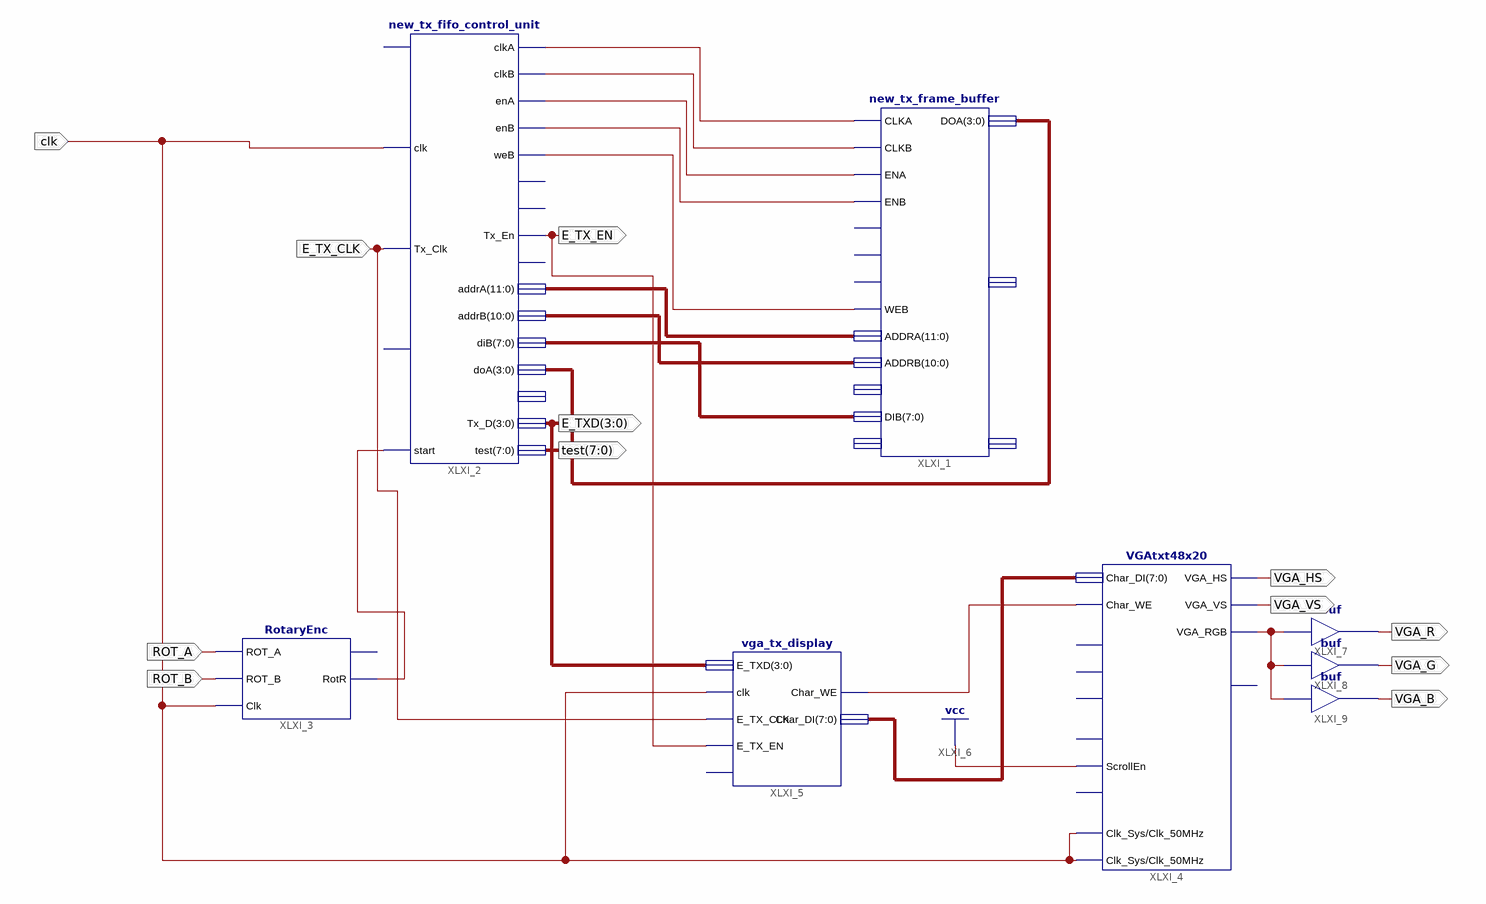
[diagram p0: schematic sheet 1]
// Xilinx ISE schematic tx_schem.sch (spartan3e) as structural Verilog: 8 symbols, 12 ports
module tx_schem (
  input  clk,
  input  E_TX_CLK,
  input  ROT_A,
  input  ROT_B,
  output VGA_HS,
  output VGA_VS,
  output VGA_B,
  output VGA_G,
  output VGA_R,
  output E_TX_EN,
  output [3:0] E_TXD,
  output [7:0] test
);

  wire XLXN_1, XLXN_2, XLXN_3, XLXN_4, XLXN_5, XLXN_10, XLXN_24, XLXN_33;
  wire [3:0] XLXN_9;
  wire [7:0] XLXN_8, XLXN_20;
  wire [10:0] XLXN_7;
  wire [11:0] XLXN_6;

  new_tx_frame_buffer XLXI_1 (
    .CLKA(XLXN_1), .CLKB(XLXN_2), .ENA(XLXN_3), .ENB(XLXN_4), .WEB(XLXN_5), .ADDRA(XLXN_6), .ADDRB(XLXN_7),
    .DIB(XLXN_8), .DOA(XLXN_9));  // open: SSRA, SSRB, WEA, DIA, DIPB, DOB, DOPB
  new_tx_fifo_control_unit XLXI_2 (
    .clk(clk), .Tx_Clk(E_TX_CLK), .start(XLXN_10), .doA(XLXN_9), .clkA(XLXN_1), .clkB(XLXN_2), .enA(XLXN_3),
    .enB(XLXN_4), .weB(XLXN_5), .Tx_En(E_TX_EN), .addrA(XLXN_6), .addrB(XLXN_7), .diB(XLXN_8), .Tx_D(E_TXD),
    .test(test));  // open: EOF, PUSH, data_in, empty, full, busy
  RotaryEnc XLXI_3 (.ROT_A(ROT_A), .ROT_B(ROT_B), .RotR(XLXN_10), .Clk(clk));  // open: RotL
  VGAtxt48x20 XLXI_4 (
    .Char_DI(XLXN_20), .Clk_Sys(clk), .Clk_50MHz(clk), .ScrollEn(1'b1), .VGA_HS(VGA_HS), .VGA_VS(VGA_VS),
    .VGA_RGB(XLXN_24), .Char_WE(XLXN_33));  // open: Home, NewLine, Goto00, CursorOn, ScrollClear, Busy
  vga_tx_display XLXI_5 (
    .clk(clk), .E_TX_CLK(E_TX_CLK), .E_TX_EN(E_TX_EN), .E_TXD(E_TXD), .Char_WE(XLXN_33), .Char_DI(XLXN_20));  // open: reset
  buf XLXI_7 (VGA_R, XLXN_24);
  buf XLXI_8 (VGA_G, XLXN_24);
  buf XLXI_9 (VGA_B, XLXN_24);
endmodule
